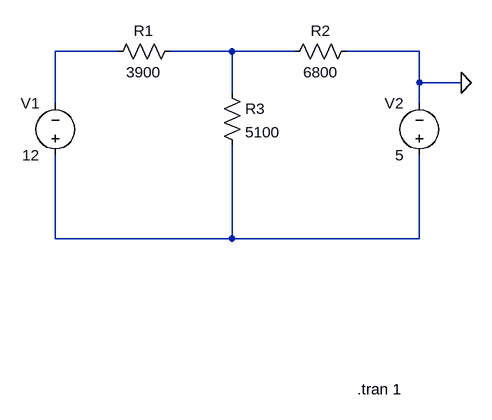
[diagram p0: schematic Lab 6.asc]
Lab 6.asc, the LTspice schematic file:
Version 4
SHEET 1 880 680
WIRE 16 80 -80 80
WIRE 192 80 96 80
WIRE 288 80 192 80
WIRE 480 80 368 80
WIRE 480 128 480 80
WIRE 544 128 480 128
WIRE 192 144 192 80
WIRE -80 160 -80 80
WIRE 480 160 480 128
WIRE -80 368 -80 240
WIRE 192 368 192 224
WIRE 192 368 -80 368
WIRE 480 368 480 240
WIRE 480 368 192 368
FLAG 544 128 0
SYMBOL voltage -80 256 R180
WINDOW 0 24 96 Left 2
WINDOW 3 24 16 Left 2
WINDOW 123 0 0 Left 2
WINDOW 39 0 0 Left 2
SYMATTR InstName V1
SYMATTR Value 12
SYMBOL voltage 480 256 R180
WINDOW 0 24 96 Left 2
WINDOW 3 24 16 Left 2
WINDOW 123 0 0 Left 2
WINDOW 39 0 0 Left 2
SYMATTR InstName V2
SYMATTR Value 5
SYMBOL res 0 96 R270
WINDOW 0 32 56 VTop 2
WINDOW 3 0 56 VBottom 2
SYMATTR InstName R1
SYMATTR Value 3900
SYMBOL res 272 96 R270
WINDOW 0 32 56 VTop 2
WINDOW 3 0 56 VBottom 2
SYMATTR InstName R2
SYMATTR Value 6800
SYMBOL res 176 128 R0
SYMATTR InstName R3
SYMATTR Value 5100
TEXT 384 600 Left 2 !.tran 1

The netlist it stands for:
* Lab 6.asc
V1 N003 N001 12
V2 N003 0 5
R1 N001 N002 3900
R2 N002 0 6800
R3 N002 N003 5100
.tran 1
.backanno
.end

* Results of the author's LTspice run, read from the files saved beside the schematic
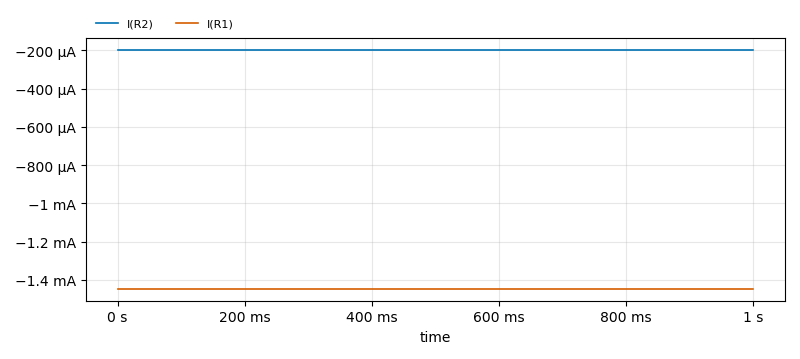
[diagram p1: Transient Analysis of Lab 6.asc, plotted from the saved traces]
* Transient Analysis, 1 run:
*   I(R2): min -199.8 µA, max -199.8 µA, average -199.8 µA, rms 199.8 µA, last -199.8 µA
*   I(R1): min -1.447 mA, max -1.447 mA, average -1.447 mA, rms 1.447 mA, last -1.447 mA